# Altium schematic sheet [03] - CONNECTORS.SchDoc
size A2; DocumentNumber: 3; SheetNumber: 3; SheetTotal: 20
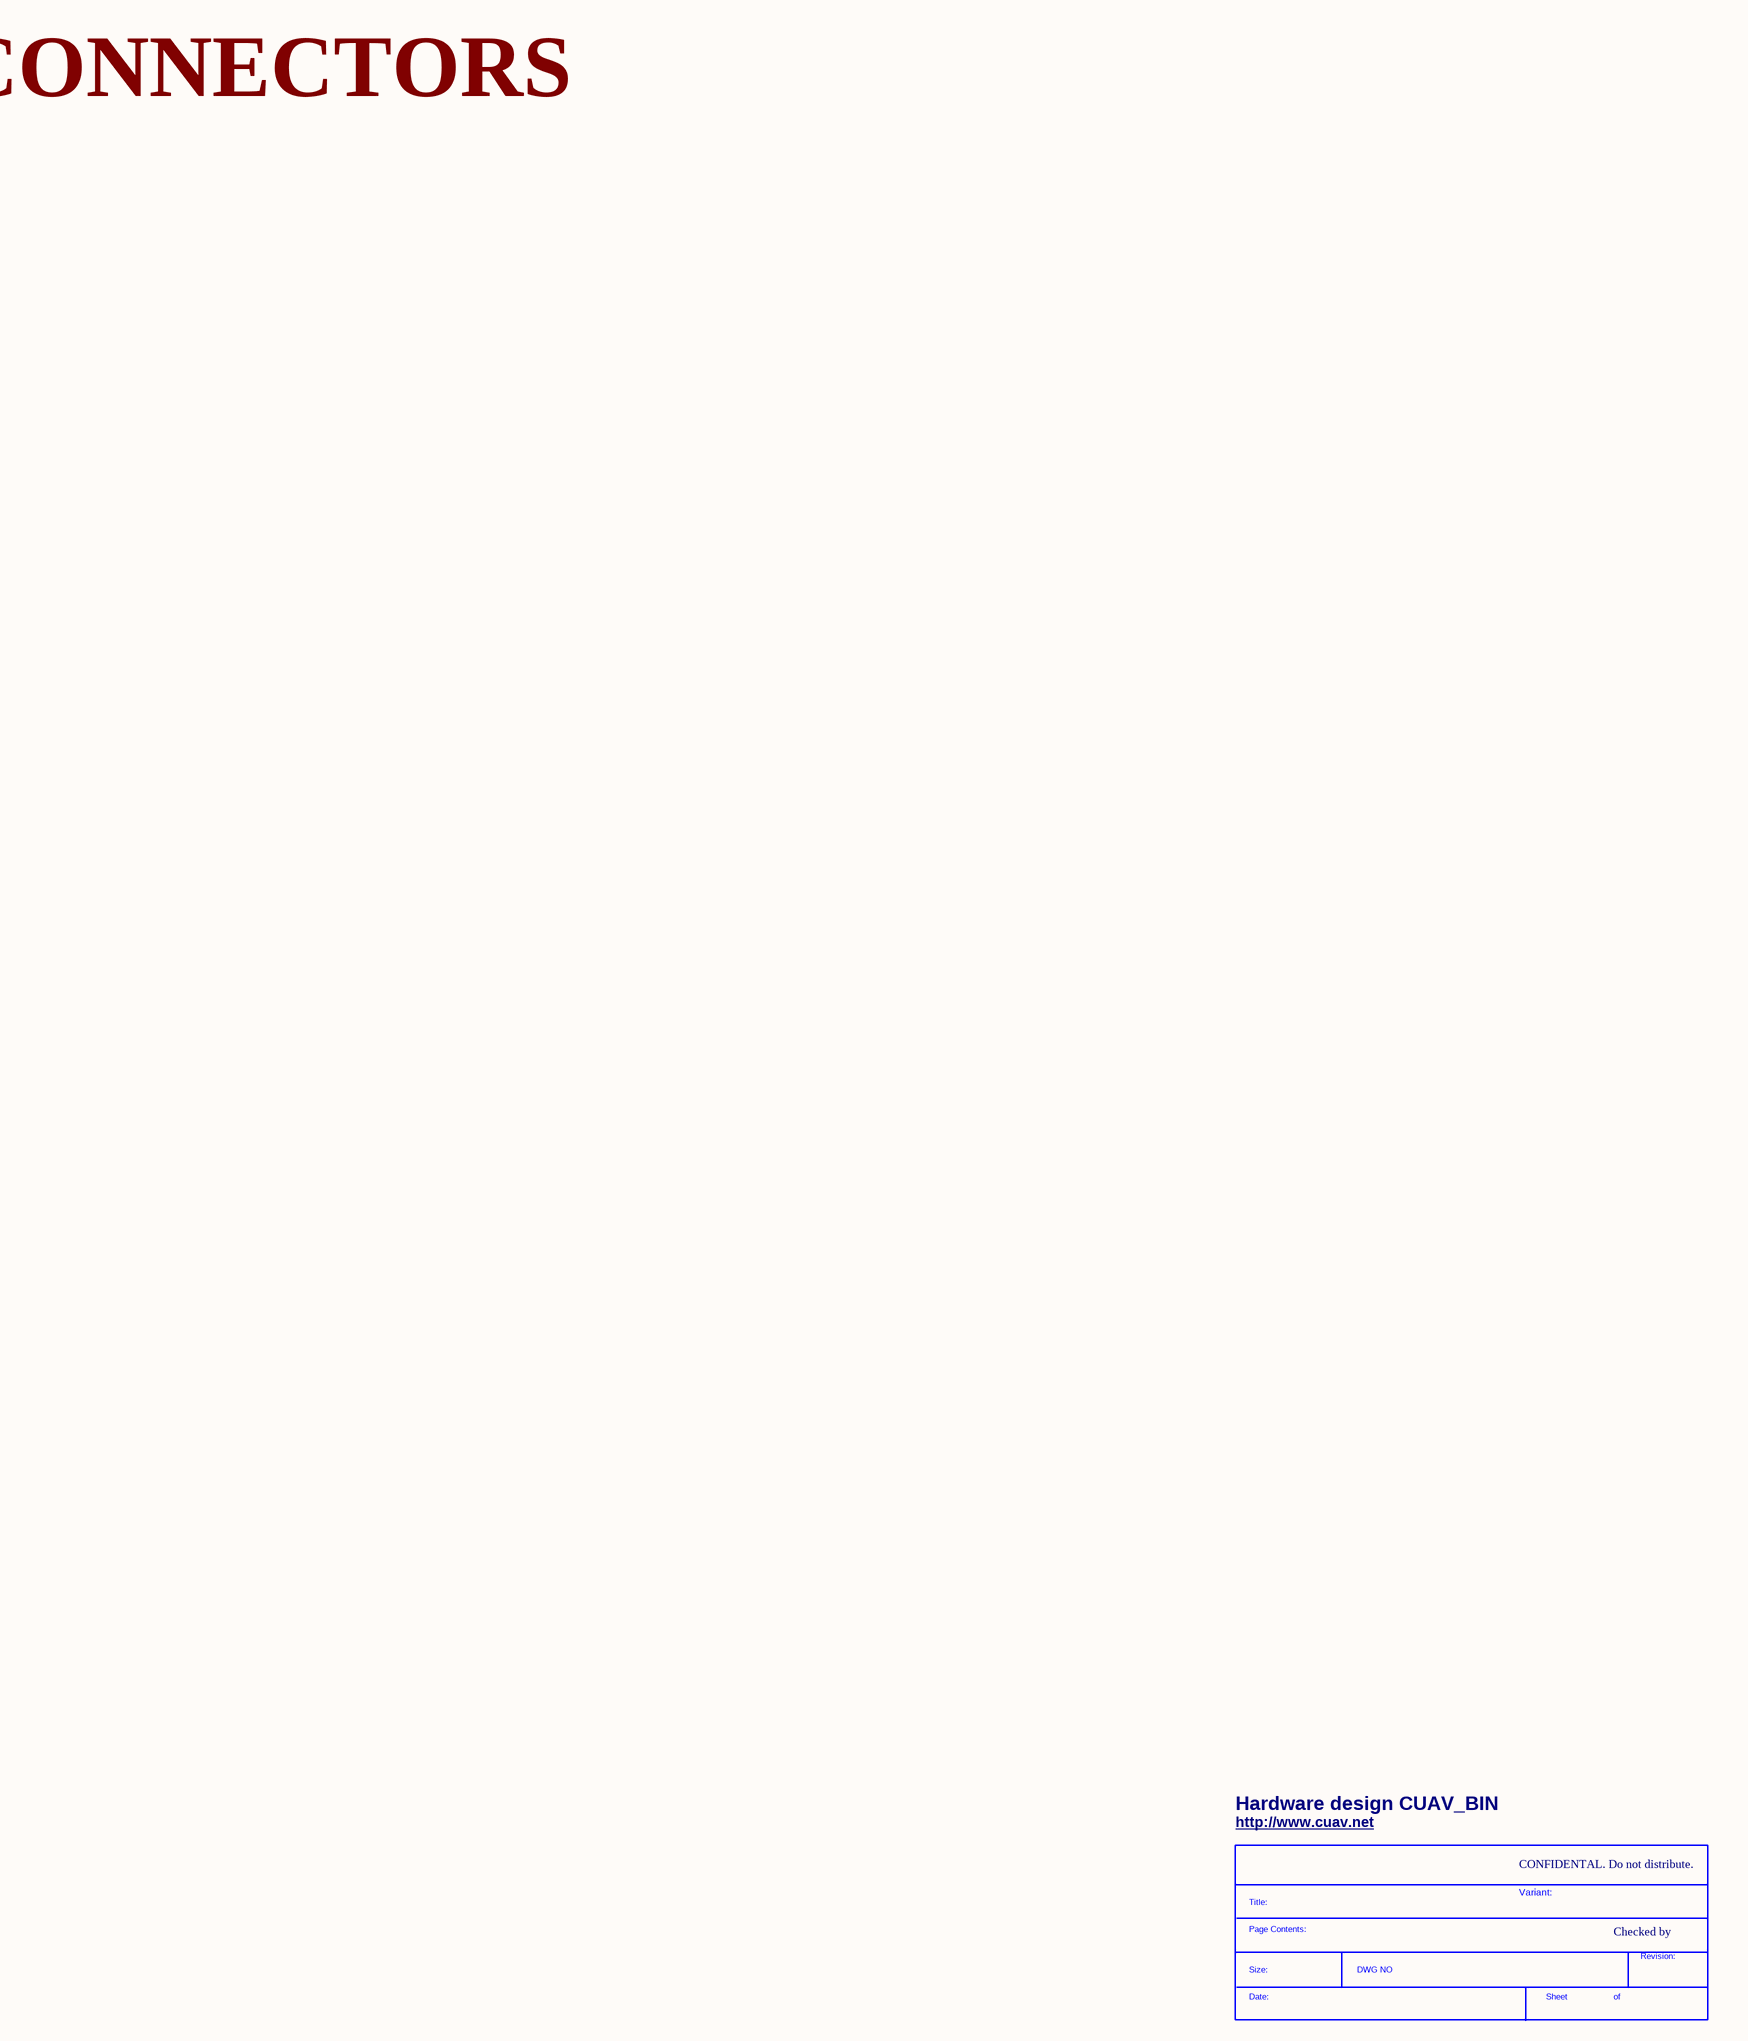
[diagram p0: [03] - CONNECTORS.SchDoc]

## Parts
*  SDTitleBlock  (value not drawn)  (graphical)

## Notes on the sheet
- CONNECTORS
- (near *) Hardware design CUAV_BIN
- (near *) http://www.cuav.net
- CONFIDENTAL. Do not distribute.
- Variant:
- Checked by
- (in symbol SDTitleBlock) Title:; Page Contents:; Revision:; Size:; DWG NO; Date:; Sheet; of